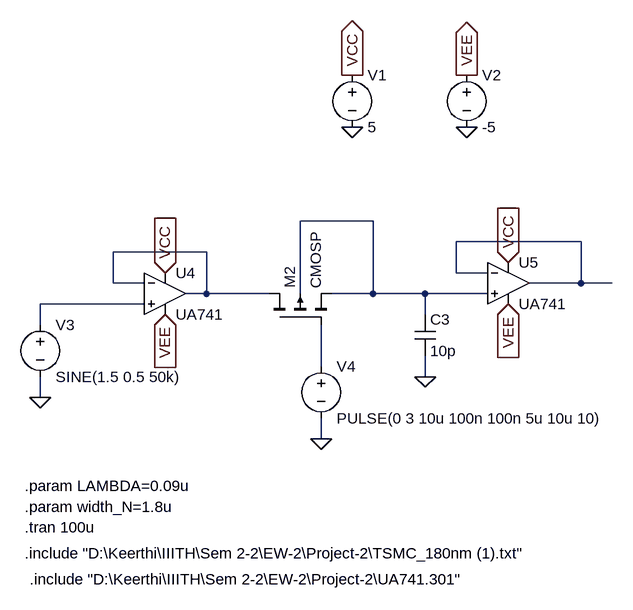
[diagram p0: schematic snh.asc]
snh.asc, the LTspice schematic file:
Version 4.1
SHEET 1 4048 832
WIRE 3216 -16 3104 -16
WIRE 3536 16 3344 16
WIRE 2960 32 2816 32
WIRE 3344 64 3344 16
WIRE 3392 64 3344 64
WIRE 2816 80 2816 32
WIRE 2864 80 2816 80
WIRE 3536 80 3536 16
WIRE 3536 80 3456 80
WIRE 3584 80 3536 80
WIRE 2960 96 2960 32
WIRE 2960 96 2928 96
WIRE 3056 96 2960 96
WIRE 3104 96 3104 -16
WIRE 3216 96 3216 -16
WIRE 3216 96 3152 96
WIRE 3296 96 3216 96
WIRE 3392 96 3296 96
WIRE 2864 112 2704 112
WIRE 3296 128 3296 96
WIRE 2704 144 2704 112
WIRE 3136 208 3136 144
WIRE 3296 224 3296 192
WIRE 2704 256 2704 224
WIRE 3136 320 3136 288
FLAG 2704 256 0
FLAG 3296 224 0
FLAG 3136 320 0
FLAG 2896 128 VEE
IOPIN 2896 128 In
FLAG 3424 112 VEE
IOPIN 3424 112 In
FLAG 2896 64 VCC
IOPIN 2896 64 In
FLAG 3424 48 VCC
IOPIN 3424 48 In
FLAG 3184 -160 0
FLAG 3360 -160 0
FLAG 3184 -240 VCC
IOPIN 3184 -240 Out
FLAG 3360 -240 VEE
IOPIN 3360 -240 Out
SYMBOL voltage 2704 128 R0
WINDOW 123 0 0 Left 0
WINDOW 39 0 0 Left 0
SYMATTR InstName V3
SYMATTR Value SINE(1.5 0.5 50k)
SYMBOL cap 3280 128 R0
SYMATTR InstName C3
SYMATTR Value 10p
SYMBOL pmos4 3056 144 R270
SYMATTR InstName M2
SYMATTR Value CMOSP
SYMATTR Value2 l={2*{LAMBDA}} w={width_N} ad={5*width_N*{LAMBDA}} as={5*width_N*{LAMBDA}} pd={10*{LAMBDA}+2*width_N} ps={10*{LAMBDA}+2*width_N}
SYMBOL voltage 3136 192 R0
WINDOW 123 0 0 Left 0
WINDOW 39 0 0 Left 0
SYMATTR InstName V4
SYMATTR Value PULSE(0 3 10u 100n 100n 5u 10u 10)
SYMBOL OpAmps\\opamp2 2896 32 R0
SYMATTR InstName U4
SYMATTR Value UA741
SYMBOL OpAmps\\opamp2 3424 16 R0
SYMATTR InstName U5
SYMATTR Value UA741
SYMBOL voltage 3184 -256 R0
WINDOW 123 0 0 Left 0
WINDOW 39 0 0 Left 0
SYMATTR InstName V1
SYMATTR Value 5
SYMBOL voltage 3360 -256 R0
WINDOW 123 0 0 Left 0
WINDOW 39 0 0 Left 0
SYMATTR InstName V2
SYMATTR Value -5
TEXT 2680 496 Left 2 !.include "D:\\Keerthi\\IIITH\\Sem 2-2\\EW-2\\Project-2\\TSMC_180nm (1).txt"
TEXT 2688 536 Left 2 !.include "D:\\Keerthi\\IIITH\\Sem 2-2\\EW-2\\Project-2\\UA741.301"
TEXT 2680 456 Left 2 !.tran 100u
TEXT 2680 392 Left 2 !.param LAMBDA=0.09u
TEXT 2680 424 Left 2 !.param width_N=1.8u

The netlist it stands for:
* snh.asc
V3 N004 0 SINE(1.5 0.5 50k)
C3 N001 0 10p
M2 N003 N005 N001 N001 CMOSP l={2*{LAMBDA}} w={width_N} ad={5*width_N*{LAMBDA}} as={5*width_N*{LAMBDA}} pd={10*{LAMBDA}+2*width_N} ps={10*{LAMBDA}+2*width_N}
V4 N005 0 PULSE(0 3 10u 100n 100n 5u 10u 10)
X§U4 N004 N003 VCC VEE N003 UA741  ; pins In+ In- V+ V- OUT
X§U5 N001 N002 VCC VEE N002 UA741  ; pins In+ In- V+ V- OUT
V1 VCC 0 5
V2 VEE 0 -5
.model NMOS NMOS
.model PMOS PMOS
.lib standard.mos
.include "D:\Keerthi\IIITH\Sem 2-2\EW-2\Project-2\TSMC_180nm (1).txt"
.include "D:\Keerthi\IIITH\Sem 2-2\EW-2\Project-2\UA741.301"
.tran 100u
.param LAMBDA=0.09u
.param width_N=1.8u
.backanno
.end